# EAGLE design pyboard_arcobaleno (EAGLE 9.5.1)
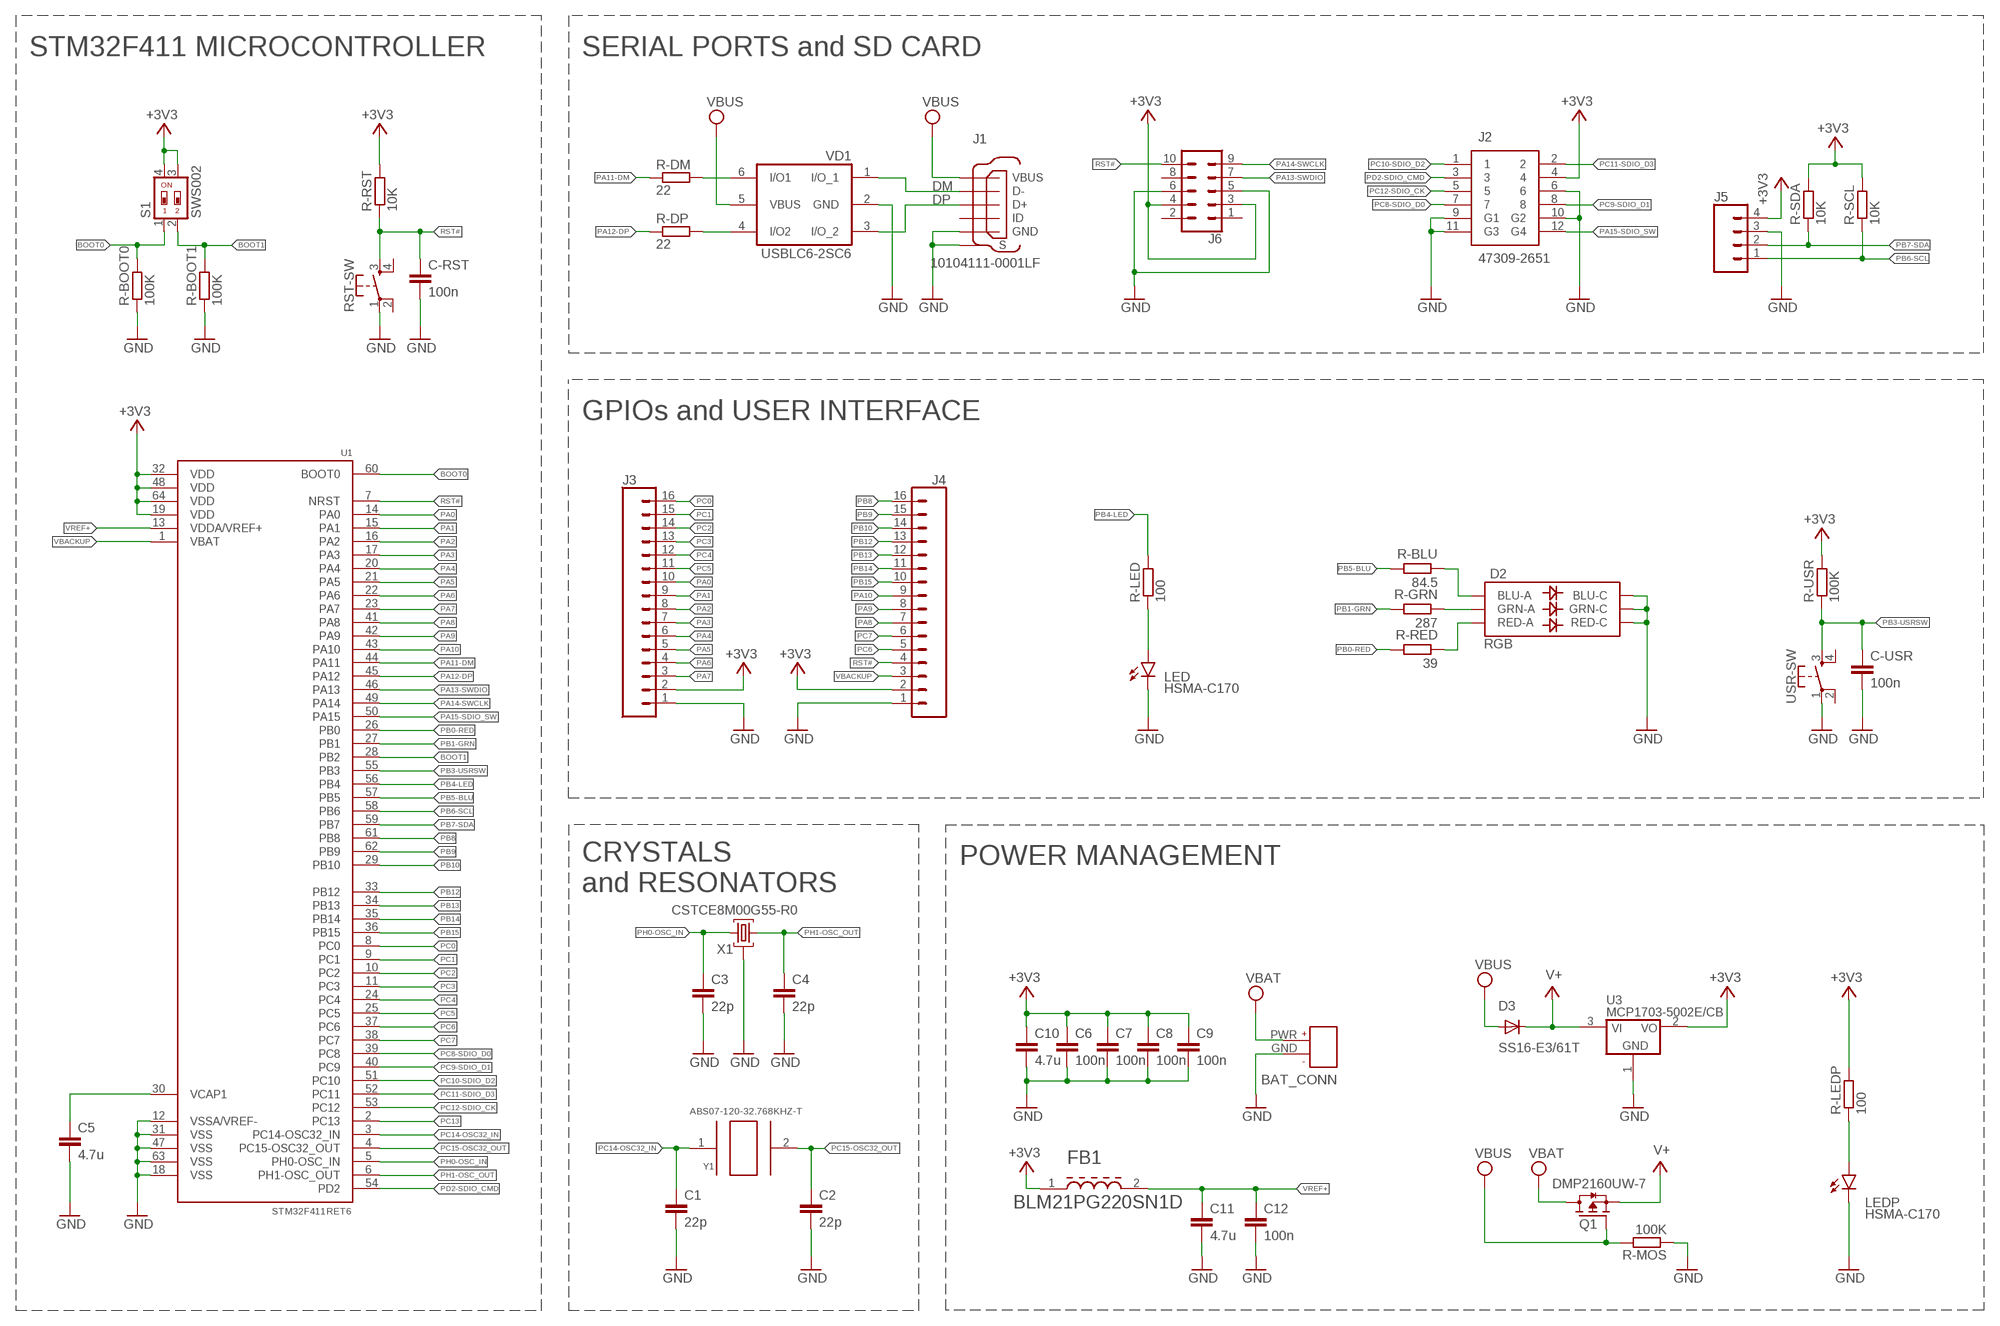
[diagram p0: schematic, sheet 1]

## Parts
BAT_CONN  JST_PH_2PIN  [JST_PH_2PIN]
C1  22p  C-EUC0603  [C0603]
C2  22p  C-EUC0603  [C0603]
C3  22p  C-EUC0603  [C0603]
C4  22p  C-EUC0603  [C0603]
C5  4.7u  C-EUC1608  [C1608]
C6  100n  C-EUC0603  [C0603]
C7  100n  C-EUC0603  [C0603]
C8  100n  C-EUC0603  [C0603]
C9  100n  C-EUC0603  [C0603]
C10  4.7u  C-EUC1608  [C1608]
C11  4.7u  C-EUC1608  [C1608]
C12  100n  C-EUC0603  [C0603]
C-RST  100n  C-EUC0603  [C0603]
C-USR  100n  C-EUC0603  [C0603]
D2  RGB  LED-RGBPLCC-6  [PLCC-6-LED]
D3  SS16-E3/61T  DIODE-DO214AA  [DO214AA]
FB1  MURATA_BLM21PG220SN1DMURATA_BLM21PG220SN1D_0_0  [MURATA_BLM21PG220SN1D_0]
J1  10104111-0001LF  [FRAMATOME_10104111-0001LF]
J2  47309-2651  [47309-2651]
J3  CONN_16  [1X16]
J4  CONN_16  [1X16]
J5  CONN_04  [1X04]
J6  CONN_05X2PTH  [2X5]
LED  HSMA-C170  LEDCHIPLED_0805  [CHIPLED_0805]
LEDP  HSMA-C170  LEDCHIPLED_0805  [CHIPLED_0805]
Q1  DMP2160UW-7  [SOT65P210X110-3N]
R-BLU  84.5  R-EU_R0603  [R0603]
R-BOOT0  100K  R-EU_R0603  [R0603]
R-BOOT1  100K  R-EU_R0603  [R0603]
R-DM  22  R-EU_R0603  [R0603]
R-DP  22  R-EU_R0603  [R0603]
R-GRN  287  R-EU_R0603  [R0603]
R-LED  100  R-EU_R0603  [R0603]
R-LEDP  100  R-EU_R0603  [R0603]
R-MOS  100K  R-EU_R0603  [R0603]
R-RED  39  R-EU_R0603  [R0603]
R-RST  10K  R-EU_R0603  [R0603]
R-SCL  10K  R-EU_R0603  [R0603]
R-SDA  10K  R-EU_R0603  [R0603]
R-USR  100K  R-EU_R0603  [R0603]
RST-SW  MOMENTARY-SWITCH-SPST-2-SMD-5.2MM  [TACTILE_SWITCH_SMD_5.2MM]
S1  SWS002  [SMS-002]
U1  STM32F411RET6  [QFP50P1200X1200X160-64N]
U3  MCP1703-5002E/CB  [SOT23A_MICROCHIP_CB]
USR-SW  MOMENTARY-SWITCH-SPST-2-SMD-5.2MM  [TACTILE_SWITCH_SMD_5.2MM]
VD1  USBLC6-2SC6  [SOT-23-6L]
X1  CSTCE8M00G55-R0  [CSTCE8M00G55-R0]
Y1  ABS07-120-32.768KHZ-T  [XTAL_ABS07-120-32.768KHZ-T]

## Nets
+3V3: C6.1 C7.1 C8.1 C9.1 C10.1 FB1.1 J2.4 J3.2 J4.2 J5.4 J6.3 J6.4 R-LEDP.2 R-RST.2 R-SCL.2 R-SDA.2 R-USR.2 S1.3 S1.4 U1.19(VDD) U1.32(VDD) U1.48(VDD) U1.64(VDD) U3.2(VO)
BOOT0: R-BOOT0.2 S1.1 U1.60(BOOT0)
BOOT1: R-BOOT1.2 S1.2 U1.28(PB2)
DM: J1.2(D-) VD1.1(I/O_1)
DP: J1.3(D+) VD1.3(I/O_2)
GND: BAT_CONN.GND C1.2 C2.2 C3.2 C4.2 C5.2 C6.2 C7.2 C8.2 C9.2 C10.2 C11.2 C12.2 C-RST.2 C-USR.2 D2.CB(BLU-C) D2.CG(GRN-C) D2.CR(RED-C) J1.5(GND) J1.6(S) J1.7(S) J1.8(S) J1.9(S) J2.6 J2.9(G1) J2.10(G2) J2.11(G3) J3.1 J4.1 J5.3 J6.5 J6.6 LED.C LEDP.C R-BOOT0.1 R-BOOT1.1 R-MOS.1 RST-SW.1 U1.12(VSSA/VREF-) U1.18(VSS) U1.31(VSS) U1.47(VSS) U1.63(VSS) U3.1(GND) USR-SW.1 VD1.2(GND) X1.2(GND)
N$1: C5.1 U1.30(VCAP1)
N$2: R-DM.2 VD1.6(I/O1)
N$3: R-DP.2 VD1.4(I/O2)
N$4: LED.A R-LED.1
N$5: LEDP.A R-LEDP.1
N$7: D2.AB(BLU-A) R-BLU.1
N$12: D2.AG(GRN-A) R-GRN.1
N$13: D2.AR(RED-A) R-RED.1
PA0: J3.10 U1.14(PA0)
PA1: J3.9 U1.15(PA1)
PA2: J3.8 U1.16(PA2)
PA3: J3.7 U1.17(PA3)
PA4: J3.6 U1.20(PA4)
PA5: J3.5 U1.21(PA5)
PA6: J3.4 U1.22(PA6)
PA7: J3.3 U1.23(PA7)
PA8: J4.7 U1.41(PA8)
PA9: J4.8 U1.42(PA9)
PA10: J4.9 U1.43(PA10)
PA11-DM: R-DM.1 U1.44(PA11)
PA12-DP: R-DP.1 U1.45(PA12)
PA13-SWDIO: J6.7 U1.46(PA13)
PA14-SWCLK: J6.9 U1.49(PA14)
PA15-SDIO_SW: J2.12(G4) U1.50(PA15)
PB0-RED: R-RED.2 U1.26(PB0)
PB1-GRN: R-GRN.2 U1.27(PB1)
PB3-USRSW: C-USR.1 R-USR.1 U1.55(PB3) USR-SW.3
PB4-LED: R-LED.2 U1.56(PB4)
PB5-BLU: R-BLU.2 U1.57(PB5)
PB6-SCL: J5.1 R-SCL.1 U1.58(PB6)
PB7-SDA: J5.2 R-SDA.1 U1.59(PB7)
PB8: J4.16 U1.61(PB8)
PB9: J4.15 U1.62(PB9)
PB10: J4.14 U1.29(PB10)
PB12: J4.13 U1.33(PB12)
PB13: J4.12 U1.34(PB13)
PB14: J4.11 U1.35(PB14)
PB15: J4.10 U1.36(PB15)
PC0: J3.16 U1.8(PC0)
PC1: J3.15 U1.9(PC1)
PC2: J3.14 U1.10(PC2)
PC3: J3.13 U1.11(PC3)
PC4: J3.12 U1.24(PC4)
PC5: J3.11 U1.25(PC5)
PC6: J4.5 U1.37(PC6)
PC7: J4.6 U1.38(PC7)
PC8-SDIO_D0: J2.7 U1.39(PC8)
PC9-SDIO_D1: J2.8 U1.40(PC9)
PC10-SDIO_D2: J2.1 U1.51(PC10)
PC11-SDIO_D3: J2.2 U1.52(PC11)
PC12-SDIO_CK: J2.5 U1.53(PC12)
PC13: U1.2(PC13)
PC14-OSC32_IN: C1.1 U1.3(PC14-OSC32_IN) Y1.1
PC15-OSC32_OUT: C2.1 U1.4(PC15-OSC32_OUT) Y1.2
PD2-SDIO_CMD: J2.3 U1.54(PD2)
PH0-OSC_IN: C3.1 U1.5(PH0-OSC_IN) X1.1(INPUT)
PH1-OSC_OUT: C4.1 U1.6(PH1-OSC_OUT) X1.3(OUTPUT)
RST#: C-RST.1 J4.4 J6.10 R-RST.1 RST-SW.3 U1.7(NRST)
V+: D3.C Q1.2(S) U3.3(VI)
VBACKUP: J4.3 U1.1(VBAT)
VCC: D3.A J1.1(VBUS) Q1.1(G) R-MOS.2 VD1.5(VBUS) ; supply symbol labelled VBUS
VEE: BAT_CONN.PWR Q1.3(D) ; supply symbol labelled VBAT
VREF+: C11.1 C12.1 FB1.2 U1.13(VDDA/VREF+)
Unconnected: J1.4(ID) J6.1 J6.2 J6.8 RST-SW.2 RST-SW.4 USR-SW.2 USR-SW.4

## Notes on the sheet
- STM32F411 MICROCONTROLLER | SERIAL PORTS and SD CARD
- GPIOs and USER INTERFACE
- POWER MANAGEMENT
- CRYSTALS 
  and RESONATORS

## Library data of the parts
BAT_CONN = kanflo:JST_PH_2PIN: JST PH connector, 2 pins PH has 2.0mm spacing. This connector can be used for LiPo batteries Datasheet <http://www.jst-mfg.com/product/pdf/eng/ePH.pdf>
C1-C4 C6-C9 C12 C-RST C-USR = rcl:C-EU: CAPACITOR, European symbol
C5 C10 C11 = rcl:C-EU: CAPACITOR, European symbol; SPICEPREFIX: C
D2 = SparkFun-LED:LED-RGB: LED-RGB 6 pin RGB LED (no common connector) Packages: PLCC-6 LED-TRICOLOR-5050 - No built-in IC SparkFun Products: Digital Sandbox <https://www.sparkfun.com/products/12651> LED- SMD RGB <https://www.sparkfun.com/products/10866>; PROD_ID: DIO-12113
D3 = mod_diode:DIODE-: DIODE
FB1 = Murata - BLM21PG220SN1D:MURATA_BLM21PG220SN1D: MURA-FB-2; CIIVA_IDS: 1206081; COMPONENT_LINK_1_DESCRIPTION: Manufacturer URL; COMPONENT_LINK_1_URL: http://www.murata.com/; COMPONENT_LINK_3_DESCRIPTION: Package Specification; COMPONENT_LINK_3_URL: http://www.murata.com/products/catalog/pdf/c31e.pdf; DATASHEET: http://www.murata.com/products/catalog/pdf/c31e.pdf; DATASHEET_VERSION: 08/2013; DC_RESISTANCE: 0.009 Ohm Max.; FOOTPRINT_VARIANT_NAME_0: MURA-BLM21-B60-CHIP-2_V3; FOOTPRINT_VARIANT_NAME_1: MURA-BLM21-B60-CHIP-2_V2; FOOTPRINT_VARIANT_NAME_2: MURA-BLM21-B60-CHIP-2_V1; IMPEDANCE_AT_100_MHZ: 22 Ohm +/- 25%; IMPORTED: yes; IMPORTED_FROM: vault; IMPORT_TS: 1521862724; MF: Murata; MOUNTING_TECHNOLOGY: Surface Mount; MPN: BLM21PG220SN1D; OPERATING_TEMPERATURE_RANGE: -55 to 125 degC; PACKAGE: BLM21_H1050-2; PACKAGE_DESCRIPTION: 2-Pin Chip, Body 2 x 1.25 mm; PACKING: Tape and Reel; PREFIX: FB; RATED_CURRENT: 6000 mA; RELEASE_DATE: 1390553358; VAULT_GUID: 886A01B0-1CA3-40C6-A7D4-2A188A11D6CD; VAULT_REVISION: 2B2A5F9E-BB5E-4E0D-8D2F-25FF495DA6A1
J1 = micro_usb_10104111-0001LF:10104111-0001LF: Conn USB Type A/B RCP 5 POS 0.65mm Solder RA SMD 5 Terminal 1 Port T/R; AVAILABILITY: Unavailable; DESCRIPTION: Micro Usb, 2.0 Type Ab, Receptacle, Th; MF: Amphenol ICC; MP: 10104111-0001LF; PACKAGE: None; PRICE: None
J2 = microsd_47309-2651:47309-2651: 1 Micro SD Detect switch 2.65mm height Source: Datasheet <http://www.molex.com/webdocs/datasheets/pdf/en-us//0473092651_MEMORY_CARD_SOCKET.pdf>; ALLIED_NUMBER: 70374474; ALLIED_PRICE-STOCK: https://www.alliedelec.com/molex-incorporated-47309-2651/70374474/; DESCRIPTION: 1 Micro SD Detect switch 2.65mm height; HEIGHT: mm; MANUFACTURER_NAME: Molex; MANUFACTURER_PART_NUMBER: 47309-2651; MOUSER_PART_NUMBER: 538-47309-2651; MOUSER_PRICE-STOCK: https://www.mouser.com/Search/Refine.aspx?Keyword=538-47309-2651; RS_PART_NUMBER: 7025485P; RS_PRICE-STOCK: http://uk.rs-online.com/web/p/products/7025485P
J3 J4 = SparkFun-Connectors:CONN_16: Multi connection point. Often used as Generic Header-pin footprint for 0.1 inch spaced/style header connections On any of the 0.1 inch spaced packages, you can populate with these: Break Away Headers - Straight <https://www.sparkfun.com/products/116> (PRT-00116) Break Away Male Headers - Right Angle <https://www.sparkfun.com/products/553> (PRT-00553) Female Headers <https://www.sparkfun.com/products/115> (PRT-00115) Break Away Headers - Machine Pin <https://www.sparkfun.com/products/117> (PRT-00117) Break Away Female Headers - Swiss Machine Pin <https://www.sparkfun.com/products/743> (PRT-00743) For SCREWTERMINALS and SPRING TERMINALS visit here: Screw Terimnals on SparkFun.com <https://www.sparkfun.com/search/results?term=Screw+Terminals> (5mm/3.5mm/2.54mm spacing) This device is also useful as a general connection point to wire up your design to another part of your project. Our various solder wires solder well into these plated through hole pads. Hook-Up Wire - Assortment (Stranded, 22 AWG) <https://www.sparkfun.com/products/11375> (PRT-11375) Hook-Up Wire - Assortment (Solid Core, 22 AWG) <https://www.sparkfun.com/products/11367> (PRT-11367) View the entire wire category on our website here <https://www.sparkfun.com/categories/141> Special notes: Molex polarized connector foot print use with SKU : PRT-08231 with associated crimp pins and housings. 1MM SMD Version SKU: PRT-10208 NOTES ON THE VARIANTS LOCK and LOCK_LONGPADS... This footprint was designed to help hold the alignment of a through-hole component (i.e. 6-pin header) while soldering it into place. You may notice that each hole has been shifted either up or down by 0.005 of an inch from it's more standard position (which is a perfectly straight line). This slight alteration caused the pins (the squares in the middle) to touch the edges of the holes. Because they are alternating, it causes a "brace" to hold the component in place. 0.005 has proven to be the perfect amount of "off-center" position when using our standard breakaway headers. Although looks a little odd when you look at the bare footprint, once you have a header in there, the alteration is very hard to notice. Also,if you push a header all the way into place, it is covered up entirely on the bottom side.
J5 = SparkFun-Connectors:CONN_04: Multi connection point. Often used as Generic Header-pin footprint for 0.1 inch spaced/style header connections On any of the 0.1 inch spaced packages, you can populate with these: Break Away Headers - Straight <https://www.sparkfun.com/products/116> (PRT-00116) Break Away Male Headers - Right Angle <https://www.sparkfun.com/products/553> (PRT-00553) Female Headers <https://www.sparkfun.com/products/115> (PRT-00115) Break Away Headers - Machine Pin <https://www.sparkfun.com/products/117> (PRT-00117) Break Away Female Headers - Swiss Machine Pin <https://www.sparkfun.com/products/743> (PRT-00743) For SCREWTERMINALS and SPRING TERMINALS visit here: Screw Terimnals on SparkFun.com <https://www.sparkfun.com/search/results?term=Screw+Terminals> (5mm/3.5mm/2.54mm spacing) This device is also useful as a general connection point to wire up your design to another part of your project. Our various solder wires solder well into these plated through hole pads. Hook-Up Wire - Assortment (Stranded, 22 AWG) <https://www.sparkfun.com/products/11375> (PRT-11375) Hook-Up Wire - Assortment (Solid Core, 22 AWG) <https://www.sparkfun.com/products/11367> (PRT-11367) View the entire wire category on our website here <https://www.sparkfun.com/categories/141> Special notes: Molex polarized connector foot print use with SKU : PRT-08231 with associated crimp pins and housings. 1MM SMD Version SKU: PRT-10208; PROD_ID: CONN-09696
J6 = SparkFun-Connectors:CONN_05X2: Multi connection point. Often used as Generic Header-pin footprint for 0.1 inch spaced/style header connections For AVR SPI programming port, see special device with nice symbol: "AVR_SPI_PROG_5x2.dev" You can populate with any combo of single row headers, but if you'd like an exact match, check these: 2x5 AVR ICSP Male Header <https://www.sparkfun.com/products/778> (PRT-00778) 2x5 Pin Shrouded Header <https://www.sparkfun.com/products/8506> (PRT-08506) On any of the 0.1 inch spaced packages, you can populate with these: Break Away Headers - Straight <https://www.sparkfun.com/products/116> (PRT-00116) Break Away Male Headers - Right Angle <https://www.sparkfun.com/products/553> (PRT-00553) Female Headers <https://www.sparkfun.com/products/115> (PRT-00115) Break Away Headers - Machine Pin <https://www.sparkfun.com/products/117> (PRT-00117) Break Away Female Headers - Swiss Machine Pin <https://www.sparkfun.com/products/743> (PRT-00743) Special note: the shrouded connector mates well with our 5x2 ribbon cables: 2x5 Pin IDC Ribbon Cable <https://www.sparkfun.com/products/8535> (PRT-08535); PROD_ID: CONN-08499; SF_ID: PRT-0778
LED LEDP = led:LED: LED OSRAM: - CHIPLED LG R971, LG N971, LY N971, LG Q971, LY Q971, LO R971, LY R971 LH N974, LH R974 LS Q976, LO Q976, LY Q976 LO Q996 - Hyper CHIPLED LW Q18S LB Q993, LB Q99A, LB R99A - SideLED LS A670, LO A670, LY A670, LG A670, LP A670 LB A673, LV A673, LT A673, LW A673 LH A674 LY A675 LS A676, LA A676, LO A676, LY A676, LW A676 LS A679, LY A679, LG A679 - Hyper Micro SIDELED® LS Y876, LA Y876, LO Y876, LY Y876 LT Y87S - SmartLED LW L88C, LW L88S LB L89C, LB L89S, LG L890 LS L89K, LO L89K, LY L89K LS L896, LA L896, LO L896, LY L896 - TOPLED LS T670, LO T670, LY T670, LG T670, LP T670 LSG T670, LSP T670, LSY T670, LOP T670, LYG T670 LG T671, LOG T671, LSG T671 LB T673, LV T673, LT T673, LW T673 LH T674 LS T676, LA T676, LO T676, LY T676, LB T676, LH T676, LSB T676, LW T676 LB T67C, LV T67C, LT T67C, LS T67K, LO T67K, LY T67K, LW E67C LS E67B, LA E67B, LO E67B, LY E67B, LB E67C, LV E67C, LT E67C LW T67C LS T679, LY T679, LG T679 LS T770, LO T770, LY T770, LG T770, LP T770 LB T773, LV T773, LT T773, LW T773 LH T774 LS E675, LA E675, LY E675, LS T675 LS T776, LA T776, LO T776, LY T776, LB T776 LHGB T686 LT T68C, LB T68C - Hyper Mini TOPLED® LB M676 - Mini TOPLED Santana® LG M470 LS M47K, LO M47K, LY M47K Source: http://www.osram.convergy.de LUXEON: - LUMILED® LXK2-PW12-R00, LXK2-PW12-S00, LXK2-PW14-U00, LXK2-PW14-V00 LXK2-PM12-R00, LXK2-PM12-S00, LXK2-PM14-U00 LXK2-PE12-Q00, LXK2-PE12-R00, LXK2-PE12-S00, LXK2-PE14-T00, LXK2-PE14-U00 LXK2-PB12-K00, LXK2-PB12-L00, LXK2-PB12-M00, LXK2-PB14-N00, LXK2-PB14-P00, LXK2-PB14-Q00 LXK2-PR12-L00, LXK2-PR12-M00, LXK2-PR14-Q00, LXK2-PR14-R00 LXK2-PD12-Q00, LXK2-PD12-R00, LXK2-PD12-S00 LXK2-PH12-R00, LXK2-PH12-S00 LXK2-PL12-P00, LXK2-PL12-Q00, LXK2-PL12-R00 Source: www.luxeon.com KINGBRIGHT: KA-3528ASYC Source: www.kingbright.com
Q1 = DMP2160UW-7:DMP2160UW-7: DMP2160UW Series 20 V 100 mOhm P-Channel Enhancement Mode Mosfet - SOT-323; DESCRIPTION: DMP2160UW Series 20 V 100 mOhm P-Channel Enhancement Mode Mosfet - SOT-323; DIGI-KEY_PART_NUMBER: DMP2160UWDICT-ND; DIGI-KEY_PURCHASE_URL: https://www.digikey.com/product-detail/en/diodes-incorporated/DMP2160UW-7/DMP2160UWDICT-ND/2052808?utm_source=snapeda&utm_medium=aggregator&utm_campaign=symbol; MF: Diodes Inc.; MP: DMP2160UW-7; PACKAGE: SOT-323 Diodes Inc.
R-BLU R-BOOT0 R-BOOT1 R-DM R-DP R-GRN R-LED R-LEDP R-MOS R-RED R-RST R-SCL R-SDA R-USR = rcl:R-EU_: RESISTOR, European symbol
RST-SW USR-SW = SparkFun-Switches:MOMENTARY-SWITCH-SPST-2: Momentary Switch (Pushbutton) - SPST - Two Circuits Normally-open (NO) SPST momentary switches (buttons, pushbuttons). Schematic symbol includes two switch circuits. Variants SMD-4.6MMX2.8MM - 4.60mm x 2.80mm Tactile Momentary Button Switch - Used on SparkFun SAMD21 Mini Breakout <https://www.sparkfun.com/products/13664> SMD-5.2MM - Mini Pushbutton Switch - SMD <https://www.sparkfun.com/products/8720> - Used on Arduino Pro Mini <https://www.sparkfun.com/products/11114>; PROD_ID: SWCH-08247; SF_SKU: COM-08720
S1 = smd-special:SWS002: SMD Dip Switch 2 pol.
U1 = STM32F411RET6:STM32F411RET6: High-performance access line, ARM Cortex-M4 core with DSP and FPU, 512 Kbytes Flash, 100 MHz CPU, ART Accelerator; AVAILABILITY: Unavailable; DESCRIPTION: High-performance access line, ARM Cortex-M4 core with DSP and FPU, 512 Kbytes Flash, 100 MHz CPU, ART Accelerator; MF: STMicroelectronics; MP: STM32F411RET6; PACKAGE: LQFP-64 STMicroelectronics; PRICE: None
U3 = MCP1703:MCP1703*02E/CB: MCP1703[A] Series of Voltage Regulators – SOT23A (Microchip CB) (1.2 … 5.0)V, LDO, 16 V Input, 100/150/200/250 mA, Low Quiescent Current Source: http://ww1.microchip.com/downloads/en/DeviceDoc/22049f.pdf http://ww1.microchip.com/downloads/en/DeviceDoc/25122A.pdf Packages: SOT23, Microchip package identifier "CB" (dimensions and recommended land patterns acc. to Microchip) Technologies: MCP1703[A]T-xx02E/CB T : Tape and Reel xx: Output Voltage * 1000 mV; 12|15|18|25|28|30|33|40|50 0 : Extra Feature Code (fixed) 2 : Output volt. Tol.: ±2% (standard) E : Temperature range (−40…+125)°C CB: Package: SOT23A Author: Dipl.-Ing. FH Rainer Bayer HHN Hochschule Heilbronn, rainer.bayer@hs-heilbronn.de Ingenieurbüro ing-rb, mail@ing-rb.de
VD1 = usblc6:USBLC6-2: VERY LOW CAPACITANCE ESD PROTECTION 2 line Datasheet link <http://www.st.com/web/catalog/sense_power/FM114/CL1137/SC1489/PF93353>
X1 = Crystals:CSTCE8M00G55-R0: CER RES 8.0000MHZ 33PF SMD Manufacturer's datasheet <https://www.murata.com/~/media/webrenewal/support/library/catalog/products/timingdevice/ceralock/p16e.ashx>; CREATED_BY: PCBLayout.com; DIGIKEY_PART_NUMBER: 490-1195-2-ND; MANUFACTURER: Murata Electronics North America; MPN: CSTCE8M00G55-R0; PACKAGE: SMD-3
Y1 = ABS07-120-32.768KHZ-T:ABS07-120-32.768KHZ-T: 3.2 x 1.5mm, 32.768KHZ Xtal 6pf, 20ppm, -40+85C, ESR 60kOhm, ST Micro Ref Design Crystal for STM32L; DESCRIPTION: 3.2 x 1.5mm, 32.768KHZ Xtal 6pf, 20ppm, -40+85C, ESR 60kOhm, ST Micro Ref Design Crystal for STM32L; DIGI-KEY_PART_NUMBER: 535-11937-1-ND; DIGI-KEY_PURCHASE_URL: https://www.digikey.com/product-detail/en/abracon-llc/ABS07-120-32.768KHZ-T/535-11937-1-ND/3724046?utm_source=snapeda&utm_medium=aggregator&utm_campaign=symbol; MF: Abracon; MP: ABS07-120-32.768KHZ-T; PACKAGE: SMD-2 Abracon LLC

## Board
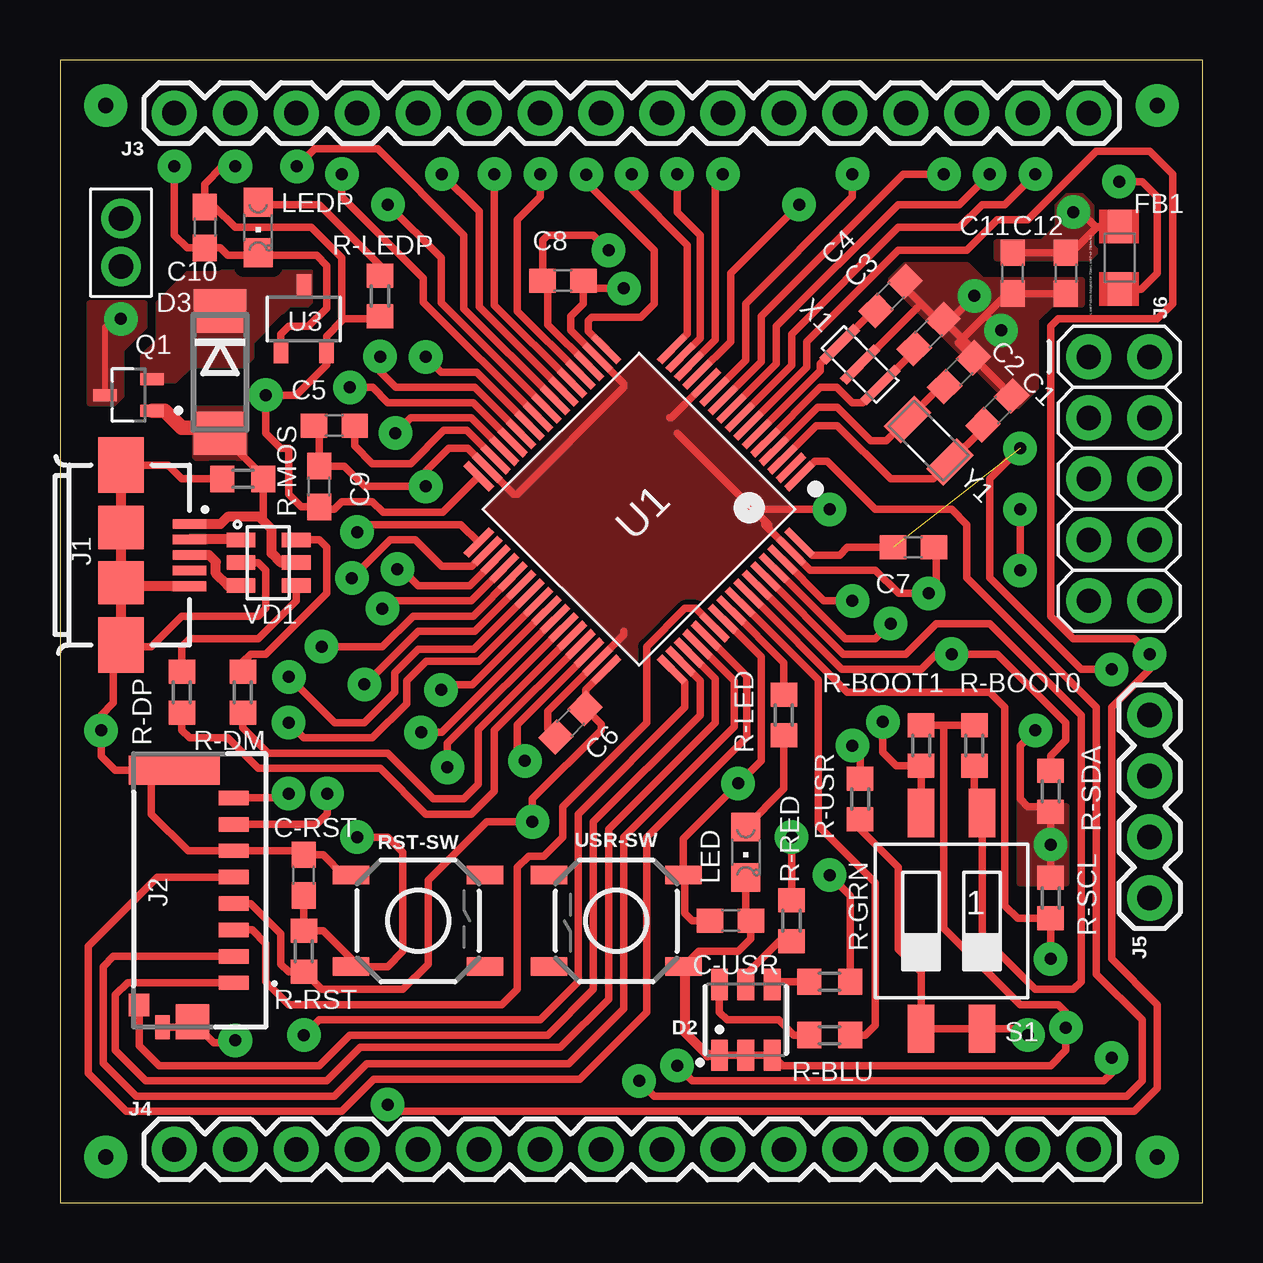
[diagram p1: board, top side]
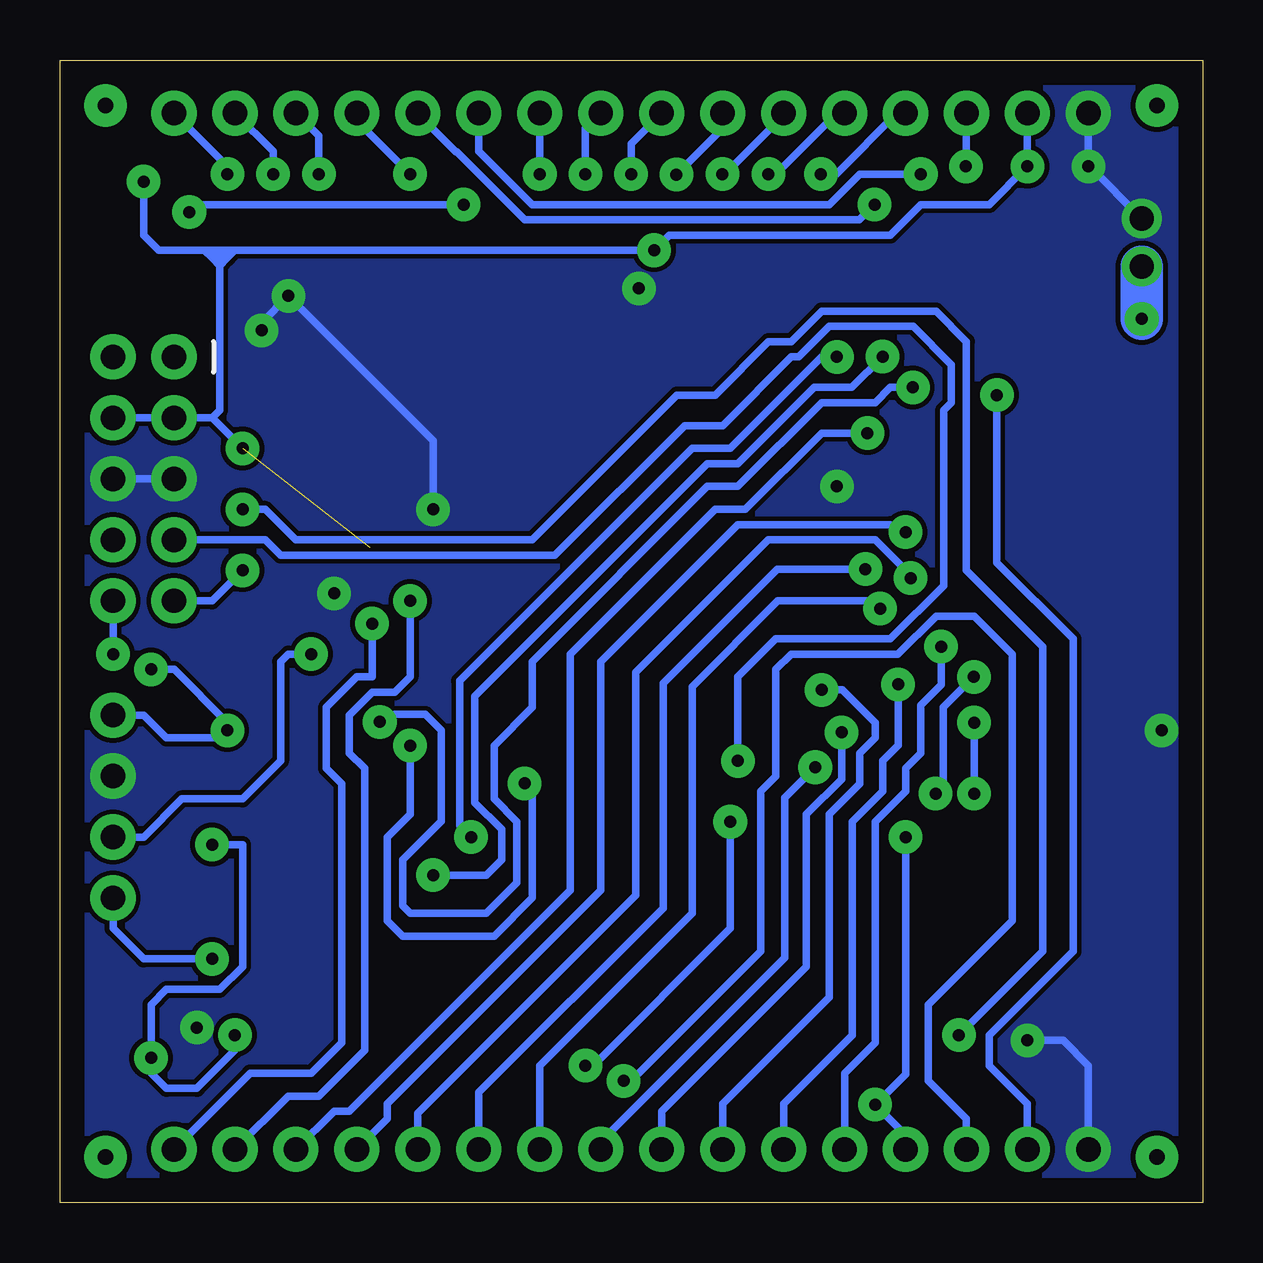
[diagram p2: board, bottom side, seen from below]

Size 47.61 x 47.62 mm. Coordinates in mm from the lower left corner, seen from the top.
Outline: 0,0 47.61,0 47.61,47.62 0,47.62 0,0
Copper layers (1*16): Top 0.035mm / dielectric 1.5mm / Bottom 0.035mm
Design rules "default *": minimum track width 10mil, minimum drill 0.5mm, track to track 8mil, track to pad 8mil, pad to pad 8mil, via to via 8mil, smd to smd 8mil, copper to edge 40mil, drill to drill 8mil, minimum pad ring 10mil, minimum via ring 8mil, stop-mask expansion 4mil, vias tented up to drill 0mil, thermal gap 10mil

### Footprints (pad centres in the part's own frame; a part is rotated, then mirrored left to right if it is on the bottom)
JST_PH_2PIN = drill 1.016 pad 1.651: GND -1,0; PWR 1,0
C0603 = smd 1.1 x 1: 1 -0.85,0; 2 0.85,0
C1608 = smd 1.1 x 1: 1 -0.85,0; 2 0.85,0
PLCC-6-LED = smd 1.3 x 0.7: AB 1.475,1.1; AG 1.475,-1.1; AR 1.475,0; CB -1.475,1.1; CG -1.475,-1.1; CR -1.475,0
DO214AA = smd 1.8 x 2.2: A 2.55,0; C -2.55,0
MURATA_BLM21PG220SN1D_0 = smd 1.4 x 1: 1 -1.3,-0.025; 2 1.3,-0.025
FRAMATOME_10104111-0001LF = smd 0.4 x 1.4: 1 -1.3,2.85; 2 -0.65,2.85; 3 0,2.85; 4 0.65,2.85; 5 1.3,2.85 | smd 2.3 x 1.9: 6 -3.75,0; 9 3.75,0 | smd 1.8 x 1.9: 7 -1.15,0; 8 1.15,0
47309-2651 = smd 0.6 x 1.25: 1 3.85,-1.325; 2 2.75,-1.325; 3 1.65,-1.325; 4 0.55,-1.325; 5 -0.55,-1.325; 6 -1.65,-1.325; 7 -2.75,-1.325; 8 -3.85,-1.325 | smd 1.2 x 3.79: 9 -5,-3.805 | smd 1.45 x 1.4: 10 5.475,-3.05 | smd 1 x 0.6: 11 5.7,-4.3 | smd 0.95 x 0.85: 12 4.775,-5.275
1X16 = drill 1.016 pad 1.88: 1 0,0; 2 2.54,0; 3 5.08,0; 4 7.62,0; 5 10.16,0; 6 12.7,0; 7 15.24,0; 8 17.78,0; 9 20.32,0; 10 22.86,0; 11 25.4,0; 12 27.94,0; 13 30.48,0; 14 33.02,0; 15 35.56,0; 16 38.1,0
1X04 = drill 1.016 pad 1.88: 1 0,0; 2 2.54,0; 3 5.08,0; 4 7.62,0
2X5 = drill 1.016 pad 1.88: 1 0,0; 2 0,2.54; 3 2.54,0; 4 2.54,2.54; 5 5.08,0; 6 5.08,2.54; 7 7.62,0; 8 7.62,2.54; 9 10.16,0; 10 10.16,2.54
CHIPLED_0805 = smd 1.2 x 1.2: A 0,-1.05; C 0,1.05
SOT65P210X110-3N = smd 0.97 x 0.5: 1 -0.98,0.65; 2 -0.98,-0.65; 3 0.98,0
R0603 = smd 1 x 1.1: 1 -0.85,0; 2 0.85,0
TACTILE_SWITCH_SMD_5.2MM = smd 1.524 x 0.762: 1 -2.794,1.905; 2 2.794,1.905; 3 -2.794,-1.905; 4 2.794,-1.905
SMS-002 = smd 1.092 x 2.007: 1 -1.27,-4.496; 2 1.27,-4.496; 3 1.27,4.496; 4 -1.27,4.496
QFP50P1200X1200X160-64N = smd 1.5 x 0.3: 1 -5.7,3.75; 2 -5.7,3.25; 3 -5.7,2.75; 4 -5.7,2.25; 5 -5.7,1.75; 6 -5.7,1.25; 7 -5.7,0.75; 8 -5.7,0.25; 9 -5.7,-0.25; 10 -5.7,-0.75; 11 -5.7,-1.25; 12 -5.7,-1.75; 13 -5.7,-2.25; 14 -5.7,-2.75; 15 -5.7,-3.25; 16 -5.7,-3.75; 33 5.7,-3.75; 34 5.7,-3.25; 35 5.7,-2.75; 36 5.7,-2.25; 37 5.7,-1.75; 38 5.7,-1.25; 39 5.7,-0.75; 40 5.7,-0.25; 41 5.7,0.25; 42 5.7,0.75; 43 5.7,1.25; 44 5.7,1.75; 45 5.7,2.25; 46 5.7,2.75; 47 5.7,3.25; 48 5.7,3.75 | smd 0.3 x 1.5: 17 -3.75,-5.7; 18 -3.25,-5.7; 19 -2.75,-5.7; 20 -2.25,-5.7; 21 -1.75,-5.7; 22 -1.25,-5.7; 23 -0.75,-5.7; 24 -0.25,-5.7; 25 0.25,-5.7; 26 0.75,-5.7; 27 1.25,-5.7; 28 1.75,-5.7; 29 2.25,-5.7; 30 2.75,-5.7; 31 3.25,-5.7; 32 3.75,-5.7; 49 3.75,5.7; 50 3.25,5.7; 51 2.75,5.7; 52 2.25,5.7; 53 1.75,5.7; 54 1.25,5.7; 55 0.75,5.7; 56 0.25,5.7; 57 -0.25,5.7; 58 -0.75,5.7; 59 -1.25,5.7; 60 -1.75,5.7; 61 -2.25,5.7; 62 -2.75,5.7; 63 -3.25,5.7; 64 -3.75,5.7
SOT23A_MICROCHIP_CB = smd 0.6 x 1: 1 -0.95,-1.35; 2 0.95,-1.35; 3 0,1.35
SOT-23-6L = smd 0.6 x 1.2: 1 -0.95,-2.3; 2 0,-2.3; 3 0.95,-2.3; 4 0.95,0; 5 0,0; 6 -0.95,0
CSTCE8M00G55-R0 = smd 0.4 x 2: 1 1.2,0; 2 0,0; 3 -1.2,0
XTAL_ABS07-120-32.768KHZ-T = smd 1 x 1.8: 1 -1.25,0; 2 1.25,0

### Placement (x,y rotation side)
BAT_CONN  2.54,40.01 270 top
C1  39.05,33.02 45 top
C2  37.47,34.61 45 top
C3  36.2,36.2 45 top
C4  34.61,37.78 45 top
C5  11.43,32.38 180 top
C6  21.27,20 225 top
C7  35.56,27.3 0 top
C8  20.95,38.42 0 top
C9  10.79,29.84 90 top
C10  6.03,40.64 270 top
C11  39.69,38.73 270 top
C12  41.91,38.73 270 top
C-RST  10.16,13.65 90 top
C-USR  27.94,11.75 0 top
D2  28.57,7.62 90 top
D3  6.67,34.61 270 top
FB1  44.13,39.37 90 top
J1  2.54,26.99 270 top
J2  8.57,13.02 270 top
J3  4.76,45.4 0 top
J4  4.76,2.22 0 top
J5  45.4,12.7 90 top
J6  42.86,35.24 270 top
LED  28.57,14.61 180 top
LEDP  8.26,40.64 180 top
Q1  2.86,33.66 180 top
R-BLU  32.07,6.99 0 top
R-BOOT0  38.1,19.05 270 top
R-BOOT1  35.88,19.05 270 top
R-DM  7.62,21.27 90 top
R-DP  5.08,21.27 90 top
R-GRN  32.07,9.21 0 top
R-LED  30.16,20.32 90 top
R-LEDP  13.34,37.78 270 top
R-MOS  7.62,30.16 0 top
R-RED  30.48,11.75 90 top
R-RST  10.16,10.48 270 top
R-SCL  41.27,12.7 90 top
R-SDA  41.27,17.14 270 top
R-USR  33.34,16.83 270 top
RST-SW  14.92,11.75 0 top
S1  37.15,11.75 180 top
U1  24.13,28.89 225 top
U3  10.16,36.83 0 top
USR-SW  23.18,11.75 180 top
VD1  9.84,26.67 270 top
X1  33.34,34.92 315 top
Y1  36.2,31.75 135 top

### Tracks (layer width: path | path; a pad name or v marks a point on that pad's centre or on a via)
+3V3  (via drill 0.5 pad 1.4)  (1 unrouted)
  Top 0.305: J2.4 7.96,12.47 9.21,11.21 9.21,9.95 9.53,9.63 R-RST.2 10.9,8.89 14.29,8.89 15.34,9.94 15.34,13.44 17.78,15.88 v19.68,15.88 19.68,16.83 22.54,19.68 22.54,19.93 C6.1 21.91,20.64 21.91,21.37 U1.48 | U1.19 20.32,36.59 20.32,38.2 C8.1 20.11,40.11 20.32,40.32 22.23,40.32 v22.86,39.69 | 17.24,30.48 U1.32 15.94,28.77 13.46,28.77 13.02,29.21 11.75,29.21 11.43,28.89 10.9,28.89 C9.1 10.06,29 9.53,29.53 9.53,31.43 9.21,31.43 8.57,32.07 v8.57,33.66 9.84,33.66 11.11,34.92 U3.2 11.11,36.12 11.75,36.75 11.75,36.83 | U1.64 31.34,26.99 32.49,26.99 32.8,27.3 C7.1 | 11.75,36.83 11.75,39.37 10.48,40.64 7.3,40.64 6.45,41.49 C10.1 6.03,42.44 6.77,43.18 v7.3,43.18 | v40.01,31.43 38.73,30.16 38.73,26.04 42.55,22.23 v43.81,22.23 | R-USR.2 33.34,15.56 34.92,13.97 34.92,10.56 35.88,9.61 S1.3 S1.4 40.06,7.25 v40.32,6.99 | R-SCL.2 v41.27,14.92 R-SDA.2 41.06,16.51 40.32,16.51 40.01,16.83 40.01,19.05 v40.64,19.68 | v25.72,5.71 26.35,5.08 43.5,5.08 43.81,5.4 v43.81,6.03 | FB1.1 45.05,38.07 45.72,38.73 45.72,41.91 45.09,42.55 v44.13,42.55 | R-LEDP.2 13.23,36.83 11.75,36.83
  Bottom 0.305: J3.2 v7.3,43.18 8.89,41.59 11.75,41.59 13.02,40.32 22.23,40.32 v22.86,39.69 40.32,39.69 | 41.27,32.7 40.96,33.02 40.96,39.05 | 41.27,32.7 J6.3 J6.4 | J5.4 44.13,20.32 43.18,19.37 40.96,19.37 v40.64,19.68 40.64,20 42.86,22.23 v43.81,22.23 | 41.27,32.7 v40.01,31.43 | v40.32,6.99 40.32,6.35 41.91,4.76 43.18,4.76 43.81,5.4 v43.81,6.03 43.81,8.26 43.18,8.89 40.96,8.89 40.01,9.84 40.01,14.92 v41.27,14.92 | J4.2 7.3,4.13 8.89,5.71 8.89,6.99 5.4,10.48 5.4,23.5 8.57,26.67 v8.57,33.66 | v19.68,15.88 19.68,11.43 25.4,5.71 v25.72,5.71 | v44.13,42.55 44.13,40.32 43.5,39.69 41.59,39.69 | 40.32,39.69 40.64,39.37 | 40.64,39.37 40.96,39.05 | 40.32,39.69 40.96,39.69 | 40.96,39.69 41.59,39.69 | 40.96,39.05 41.27,39.37 | 41.27,39.37 41.59,39.69 | 40.96,39.05 40.96,39.69 | 40.64,39.37 41.27,39.37
  pour Top (no thermals): 41.91,13.34 41.91,16.51 40.32,16.51 40.01,16.83 40.01,13.34
BOOT0
  Top 0.305: R-BOOT0.2 38.1,17.2 38.42,16.88 S1.1 38.42,11.11 40.64,8.89 42.23,8.89 42.55,9.21 42.55,20.32 38.73,24.13 36.51,24.13 35.24,22.86 32.64,22.86 U1.60
BOOT1  (via drill 0.5 pad 1.4)
  Top 0.305: v34.29,20.03 34.29,18.76 34.85,18.2 R-BOOT1.2 S1.2 | U1.28 17.21,33.34 13.66,33.34 13.03,33.97 v12.08,33.97
  Bottom 0.305: v34.29,20.03 33.97,20.03 33.66,20.35 32.38,20.35 31.72,19.68 31.72,15.9 33.34,14.29 33.34,12.38 33.02,12.06 29.84,12.06 28.57,13.34 28.57,15.88 29.53,16.83 29.53,19.05 27.94,20.64 27.94,22.54 20.64,29.84 19.37,29.84 15.88,33.34 13.65,33.34 13.02,33.97 v12.08,33.97
DM
  Top 0.406: J1.2 7.53,27.64 VD1.1
DP
  Top 0.406: J1.3 6.21,26.99 6.5,26.71 6.5,26.21 6.99,25.72 VD1.3
GND  (via drill 0.5 pad 1.4)
  Top 0.305: RST-SW.1 11.81,13.65 10.96,14.5 C-RST.2 9.99,14.67 J2.6 5.33,14.67 3.81,16.19 3.81,18.1 3.89,18.02 J2.9 2.3,18.02 1.71,18.61 v1.71,19.68 1.71,20.32 2.22,20.83 2.22,22.92 J1.9 2.6,23.18 3.81,23.18 5.08,24.45 8.26,24.45 8.57,24.77 8.57,26.35 8.26,26.67 VD1.2 | X1.2 35.88,37.47 | 35.88,37.47 35.21,38.13 C4.2 | C3.2 36.55,36.8 35.88,37.47 | C2.2 38.07,35.53 C3.2 | C1.2 C2.2 | R-BOOT0.1 36.83,19.9 | 36.83,19.9 R-BOOT1.1 | 29.53,28.09 U1.63 31.27,26.35 33.97,26.35 34.94,25.39 v36.2,25.39 36.51,25.7 36.51,27.2 C7.2 | 29.53,28.09 29.53,28.26 29.37,28.42 | 28.89,28.89 29.37,28.42 | D2.CB D2.CR D2.CG 30.11,5.71 41.27,5.71 41.91,6.35 v41.91,7.3 41.91,7.94 41.59,8.26 40.01,8.26 36.83,11.43 36.83,19.9 | J2.11 5.3,7.32 J2.10 6.4,6.67 7.2,6.67 v7.3,6.77 | U3.1 9.21,36.2 9.53,36.51 10.35,36.51 11.11,37.27 11.11,39.05 10.69,39.47 8.26,39.47 | C6.2 20.32,19.75 20.32,20.49 U1.47 23.5,23.66 23.5,23.81 | USR-SW.1 26.35,9.84 | 38.58,36.99 37.43,35.84 C2.2 | 29.53,28.09 29.37,28.25 29.37,28.42 | J1.6 4.5,30.74 5.08,30.16 R-MOS.1 | USR-SW.1 26.04,9.78 | 38.58,36.99 v39.21,36.35 | v38.1,37.78 37.11,36.8 C3.2 | 25.72,32.07 28.89,28.89 | 28.89,28.89 v32.07,28.89 | 8.26,39.47 6.99,39.47 6.67,39.79 C10.2 5.29,39.79 4.76,40.32 v4.76,43.18 | v23.5,38.1 22.12,38.1 C8.2 21.8,37.47 21.27,36.93 21.27,36.35 U1.18 23.5,34.12 23.5,33.97 19.05,29.53 18.9,29.53 U1.31 16.99,31.43 16.19,31.43 15.24,30.48 v15.24,29.84 12.7,29.84 11.85,30.7 C9.2 10.79,32.07 10.64,32.23 10.64,32.33 C5.2 | C12.2 C11.2 39.47,37.88 38.58,36.99 | LEDP.C 8.26,39.47 | U1.12 25.46,32.7 25.4,32.7 | USR-SW.1 26.61,10.48 28.26,10.48 28.79,11.01 C-USR.2 28.57,11.96 LED.C
  Top 0.406: J1.5 2.69,25.69 J1.8 | J1.6 J1.7 J1.8 | J1.8 J1.9 | D2.CB 26.99,6.14 26.04,7.1 26.04,9.78
  Bottom 0.305: J3.1 v4.76,43.18 4.71,43.18 BAT_CONN.GND | J4.1 4.76,5.71 5.82,6.77 v7.3,6.77 | v39.21,36.35 39.21,36.67 v38.1,37.78 32.07,31.75 v32.07,28.89 | J6.6 J6.5
  pour Top (no thermals): 17.78,28.89 24.13,22.54 30.48,28.89 24.13,35.24
  pour Top (no thermals): 34.61,38.42 35.24,39.05 37.78,39.05 40.64,36.2 40.64,33.97 39.85,33.18
  pour Bottom (no thermals): 0.32,47.31 47.31,47.31 47.31,0.32 0.32,0.32
  pour Top (no thermals): 40.64,36.2 40.64,36.83 41.27,37.47 42.55,37.47 42.55,38.42 38.42,38.42 38.42,37.15 39.37,37.15 40.32,36.2
N$1
  Top 0.305: U1.30 16.95,32.19 15.99,32.19 14.61,30.8 13.02,30.8 12.28,31.54 C5.1
N$2
  Top 0.305: R-DM.2 7.62,22.54 7.94,22.86 8.57,22.86 11.11,25.4 11.11,27.3 10.8,27.62 VD1.6
N$3
  Top 0.305: R-DP.2 5.08,23.18 5.4,23.5 8.26,23.5 9.84,25.08 VD1.4
N$4
  Top 0.305: LED.A 30.16,17.24 R-LED.1
N$5
  Top 0.305: LEDP.A 8.35,41.59 10.79,41.59 13.34,39.05 R-LEDP.1
N$6  (via drill 0.64 pad 1.78)
  other vias: 1.91,45.72
N$7
  Top 0.305: D2.AB 27.48,7.94 27.79,7.62 29.95,7.62 30.58,6.99 R-BLU.1
N$8  (via drill 0.64 pad 1.78)
  other vias: 1.91,1.91
N$9  (via drill 0.64 pad 1.78)
  other vias: 45.72,1.91
N$10  (via drill 0.64 pad 1.78)
  other vias: 45.72,45.72
N$12
  Top 0.305: R-GRN.1 29.79,9.21 D2.AG
N$13
  Top 0.305: D2.AR 28.57,9.5 29.98,10.9 R-RED.1
PA0  (via drill 0.5 pad 1.4)
  Top 0.305: U1.14 27.3,35.96 27.3,42.55 v27.62,42.86
  Bottom 0.305: v27.62,42.86 J3.10
PA1  (via drill 0.5 pad 1.4)
  Top 0.305: U1.15 26.67,36.03 26.67,40.32 25.72,41.27 v25.72,42.86
  Bottom 0.305: J3.9 25.72,44.77 v25.72,42.86
PA2  (via drill 0.5 pad 1.4)
  Top 0.305: U1.16 26.14,36.21 26.14,39.9 23.81,42.23 v23.81,42.86
  Bottom 0.305: J3.8 23.81,44.13 v23.81,42.86
PA3  (via drill 0.5 pad 1.4)
  Top 0.305: U1.17 22.02,36.31 22.02,36.75 22.16,36.89 24.19,36.89 24.77,37.47 24.77,39.69 21.93,42.52 v21.93,42.84
  Bottom 0.305: J3.7 20,44.77 v21.93,42.84
PA4  (via drill 0.5 pad 1.4)
  Top 0.305: U1.20 19.05,37.15 19.05,40.96 20.02,41.92 v20.02,42.86
  Bottom 0.305: v20.02,42.86 19.91,42.86 17.46,45.31 J3.6
PA5  (via drill 0.5 pad 1.4)
  Top 0.305: U1.21 18.1,37.4 v18.1,42.86
  Bottom 0.305: v18.1,42.86 17.78,42.86 15.24,45.4 J3.5
PA6  (via drill 0.5 pad 1.4)
  Top 0.305: U1.22 17.46,37.33 17.46,41.31 v15.91,42.86
  Bottom 0.305: v15.91,42.86 15.28,42.86 12.74,45.4 J3.4
PA7  (via drill 0.5 pad 1.4)
  Top 0.305: v9.87,43.18 10.6,43.92 13.23,43.92 16.83,40.32 16.83,37.26 U1.23
  Bottom 0.305: v9.87,43.18 9.84,43.18 J3.3
PA8  (via drill 0.5 pad 1.4)
  Top 0.305: U1.41 17.18,21.59 16.09,21.59 v15.88,21.37
  Bottom 0.305: v15.88,21.37 15.02,21.37 13.65,20 13.65,19.37 14.29,18.73 14.29,17.46 15.56,16.19 15.56,8.57 20,4.13 J4.7
PA9  (via drill 0.5 pad 1.4)
  Top 0.305: v15.05,19.6 15.9,19.6 U1.42
  Bottom 0.305: v15.05,19.6 15.05,17.66 16.51,16.19 16.51,9.84 22.54,3.81 J4.8
PA10  (via drill 0.5 pad 1.4)
  Top 0.305: U1.43 16.14,19.14 v16.14,18.15
  Bottom 0.305: v16.14,18.15 17.41,16.88 17.41,10.21 25.08,2.54 J4.9
PA11-DM
  Top 0.305: R-DM.1 7.62,19.79 8.68,18.73 13.65,18.73 15.56,16.83 16.83,16.83 17.43,17.43 17.43,19.72 U1.44
PA12-DP
  Top 0.305: R-DP.1 5.08,19.68 5.4,19.37 6.99,19.37 8.26,18.1 13.34,18.1 15.24,16.19 17.14,16.19 18.1,17.15 18.1,19.68 U1.45
PA13-SWDIO  (via drill 0.5 pad 1.4)
  Top 0.305: U1.46 19.05,19.92 19.05,18.73 v19.37,18.41
  Bottom 0.305: v19.37,18.41 19.37,21.91 17.78,23.5 13.02,23.5 10.79,25.72 10.79,33.02 10.48,33.34 10.48,34.92 12.06,36.51 15.56,36.51 16.83,35.24 17.14,35.24 20,32.38 21.59,32.38 26.99,26.99 38.42,26.99 39.05,27.62 J6.7
PA14-SWCLK  (via drill 0.5 pad 1.4)
  Top 0.305: U1.49 26.04,21.68 26.04,20.64 21.59,16.19 21.59,9.21 20,7.62 10.79,7.62 v10.16,6.99 | v40.01,28.89 v40.01,26.35
  Bottom 0.305: v10.16,6.99 6.67,10.48 6.67,23.18 9.84,26.35 9.84,35.88 11.11,37.15 15.88,37.15 17.14,35.88 18.1,35.88 20.32,33.66 21.91,33.66 27.94,27.62 37.78,27.62 39.05,28.89 v40.01,28.89 | v40.01,26.35 41.27,25.08 J6.9
PA15-SDIO_SW
  Top 0.305: J2.12 3.3,6.54 4.13,5.71 10.79,5.71 12.06,6.99 20.32,6.99 22.23,8.89 22.23,15.88 26.67,20.32 26.67,21.76 U1.50
PB0-RED  (via drill 0.5 pad 1.4)
  Top 0.305: R-RED.2 v30.48,15.24 | v15.24,35.24 15.88,34.61 17.35,34.61 U1.26
  Bottom 0.305: v30.48,15.24 30.96,15.72 30.96,21.75 21.27,31.43 19.68,31.43 15.88,35.24 v15.24,35.24
PB1-GRN  (via drill 0.5 pad 1.4)
  Top 0.305: v32.07,13.65 32.92,12.8 R-GRN.2 | U1.27 17.28,33.97 13.98,33.97 13.34,34.62 v13.34,35.26
  Bottom 0.305: v13.34,35.26 14.62,33.97 16.19,33.97 19.37,30.8 20.64,30.8 30.32,21.11 30.32,16.67 29.21,15.56 29.21,14.29 29.84,13.65 v32.07,13.65
PB3-USRSW  (via drill 0.5 pad 1.4)
  Top 0.305: U1.55 29.21,22.75 29.21,18.43 v28.26,17.47 v28.26,17.46 25.97,15.18 USR-SW.3 26.04,13.59 26.04,12.06 26.35,11.75 C-USR.1 | v33.02,19.05 33.34,18.73 R-USR.1
  Bottom 0.305: v28.26,17.47 27.94,17.16 27.94,12.7 29.53,11.11 33.34,11.11 33.97,11.75 33.97,15.24 33.02,16.19 v33.02,19.05
PB4-LED
  Top 0.305: R-LED.2 30.16,22.51 U1.56
PB5-BLU
  Top 0.305: R-BLU.2 33.55,6.99 33.97,7.41 33.97,13.34 31.59,15.72 31.59,21.79 U1.57
PB6-SCL  (via drill 0.5 pad 1.4)
  Top 0.305: U1.58 32.81,21.27 38.73,21.27 39.37,20.64 39.37,12.38 39.9,11.85 R-SCL.1 v41.27,10.16
  Bottom 0.305: v41.27,10.16 44.13,10.16 45.4,11.43 J5.1
PB7-SDA  (via drill 0.5 pad 1.4)
  Top 0.305: U1.59 32.56,22.23 35.88,22.23 36.51,22.86 v37.15,22.86 39.05,22.86 41.91,20 41.91,19.27 41.27,18.63 R-SDA.1
  Bottom 0.305: v37.15,22.86 38.1,22.86 38.42,22.54 38.42,18.41 40.01,16.83 42.55,16.83 44.13,15.24 J5.2
PB8  (via drill 0.5 pad 1.4)
  Top 0.305: U1.61 32.71,23.5 33.97,23.5 v34.61,24.13
  Bottom 0.305: J4.16 39.69,5.4 37.15,5.4 35.88,6.67 35.88,17.46 36.51,18.1 36.51,20.64 35.24,21.91 34.61,21.91 v34.61,24.13
PB9  (via drill 0.5 pad 1.4)
  Top 0.305: U1.62 31.83,25.08 v33.02,25.08
  Bottom 0.305: v33.02,25.08 33.02,21.91 33.66,21.27 34.61,21.27 35.56,20.32 35.56,18.73 34.92,18.1 34.92,6.35 36.83,4.45 38.1,4.45 J4.15
PB10  (via drill 0.5 pad 1.4)
  Top 0.305: U1.29 17.14,32.7 14.61,32.7 v13.97,32.07
  Bottom 0.305: v13.97,32.07 15.88,32.07 19.05,28.89 20.32,28.89 26.35,22.86 26.35,13.02 35.56,3.81 36.2,3.81 J4.14
PB12  (via drill 0.5 pad 1.4)
  Top 0.305: U1.33 16.7,28.26 12.7,28.26 v12.38,27.94
  Bottom 0.305: v12.38,27.94 12.7,27.94 13.02,28.26 19.37,28.26 25.08,22.54 25.08,13.02 33.97,4.13 33.97,3.49 J4.13
PB13  (via drill 0.5 pad 1.4)
  Top 0.305: U1.34 17.17,26.52 15.9,26.52 14.8,27.62 13.77,27.62 v12.17,26.02
  Bottom 0.305: v12.17,26.02 12.17,26.14 13.65,27.62 18.1,27.62 23.62,22.1 23.62,12.81 32.7,3.73 J4.12
PB14  (via drill 0.5 pad 1.4)
  Top 0.305: U1.35 17.07,25.72 14.92,25.72 14.24,26.4 v14.06,26.4
  Bottom 0.305: v14.06,26.4 17.73,26.4 22.48,21.65 22.48,12.28 30.16,4.6 J4.11
PB15  (via drill 0.5 pad 1.4)
  Top 0.305: U1.36 17.14,25.08 13.76,25.08 v13.44,24.76
  Bottom 0.305: v13.44,24.76 13.76,25.08 17.7,25.08 21.27,21.51 21.27,12.06 27.62,5.71 J4.10
PC0  (via drill 0.5 pad 1.4)
  Top 0.305: U1.8 30.48,34.89 30.48,36.2 34.92,40.64 37.47,40.64 38.42,41.59 39.37,41.59 v40.64,42.86
  Bottom 0.305: v40.64,42.86 40.64,43.18 J3.16
PC1  (via drill 0.5 pad 1.4)
  Top 0.305: U1.9 29.84,34.96 29.84,36.51 34.92,41.59 37.47,41.59 v38.73,42.86
  Bottom 0.305: v38.73,42.86 38.73,43.81 J3.15
PC2  (via drill 0.5 pad 1.4)
  Top 0.305: v36.83,42.86 35.13,42.86 29.22,36.95 29.22,35.04 U1.10
  Bottom 0.305: v36.83,42.86 36.83,44.45 J3.14
PC3  (via drill 0.5 pad 1.4)
  Top 0.305: U1.11 28.57,35.1 28.57,37.47 33.02,41.91 v33.02,42.86
  Bottom 0.305: J3.13 35.24,45.09 v33.02,42.86
PC4  (via drill 0.5 pad 1.4)
  Top 0.305: U1.24 15.88,37.5 15.88,39.38 v13.66,41.59
  Bottom 0.305: v13.66,41.59 14.3,40.96 28.26,40.96 31.09,43.79 31.11,43.79 32.7,45.38 J3.12
PC5  (via drill 0.5 pad 1.4)
  Top 0.305: U1.25 15.14,37.53 15.14,38.51 11.75,41.91 v11.75,42.86
  Bottom 0.305: v11.75,42.86 14.29,42.86 15.56,41.59 27.94,41.59 30.16,43.81 J3.11
PC6  (via drill 0.5 pad 1.4)
  Top 0.305: U1.37 17.21,24.45 14.71,24.45 13.44,23.17 v10.9,23.17
  Bottom 0.305: v10.9,23.17 10.9,21.59 11.75,20.73 11.75,18.73 12.38,18.1 12.38,17.14 13.65,15.88 13.65,6.67 14.92,5.4 J4.5
PC7  (via drill 0.5 pad 1.4)
  Top 0.305: U1.38 17.28,23.81 14.92,23.81 12.71,21.6 v12.69,21.6
  Bottom 0.305: v12.69,21.6 12.69,19.06 13.34,18.41 13.34,17.14 14.61,15.88 14.61,6.99 17.46,4.13 J4.6
PC8-SDIO_D0  (via drill 0.5 pad 1.4)
  Top 0.305: J2.7 10.69,15.77 11.12,16.2 v11.12,17.04 | U1.39 17.25,23.07 14.92,23.07 13.94,22.09 13.94,21.27 12.67,20 11.44,20 v9.54,21.91
  Bottom 0.305: v9.54,21.91 10.81,20.64 10.81,17.36 v11.12,17.04
PC9-SDIO_D1  (via drill 0.5 pad 1.4)
  Top 0.305: J2.8 9.25,16.87 9.42,17.04 v9.53,17.04 | v9.53,20 10.16,19.37 13.02,19.37 14.45,20.8 14.45,21.75 15.26,22.56 17.44,22.56 U1.40
  Bottom 0.305: v9.53,17.04 v9.53,20
PC10-SDIO_D2
  Top 0.305: J2.1 2.82,9.17 2.31,8.66 2.31,6.35 3.58,5.08 11.11,5.08 12.51,6.48 20.85,6.48 22.86,8.49 22.86,15.56 27.3,20 27.3,21.83 U1.51
PC11-SDIO_D3
  Top 0.305: J2.2 2.23,10.27 1.8,9.84 1.8,5.82 3.17,4.45 11.43,4.45 12.78,5.79 21.2,5.79 23.5,8.09 23.5,15.24 28.09,19.84 28.09,21.75 U1.52
PC12-SDIO_CK
  Top 0.305: J2.5 4.04,13.57 1.17,10.69 1.17,5.4 2.76,3.81 11.75,3.81 13.08,5.14 21.65,5.14 24.45,7.94 24.45,15.24 28.61,19.4 28.61,21.94 U1.53
PC14-OSC32_IN
  Top 0.305: C1.1 38.45,32.24 Y1.1 36.38,30.16 34.61,30.16 32.38,32.38 31.51,32.38 U1.3
PC15-OSC32_OUT
  Top 0.305: C2.1 36.68,34.01 Y1.2 34.43,31.75 33.78,31.75 32.38,33.15 31.57,33.15 U1.4
PD2-SDIO_CMD
  Top 0.305: J2.3 8,11.37 8.57,10.79 8.57,9.21 9.53,8.26 18.41,8.26 19.05,8.89 19.05,13.97 19.53,14.45 20.16,14.45 20.95,15.24 20.95,16.51 24.45,20 24.45,23.18 26.04,24.77 26.49,24.77 U1.54
PH0-OSC_IN
  Top 0.305: C3.1 35.59,35.48 X1.1 33.45,33.34 33.01,33.34 32.37,33.97 31.68,33.97 U1.5
PH1-OSC_OUT
  Top 0.305: U1.6 31.68,34.68 31.68,34.97 X1.3 33.9,37.18 C4.1
RST#  (via drill 0.5 pad 1.4)
  Top 0.305: U1.7 31.11,34.82 31.11,35.88 34.92,39.69 37.78,39.69 39.05,40.96 40.32,40.96 43.18,43.81 45.4,43.81 46.35,42.86 46.35,37.47 45.72,36.83 41.59,36.83 41.27,36.51 41.27,24.45 42.23,23.5 44.77,23.5 v45.4,22.86 45.4,22.23 43.81,20.64 43.81,10.16 45.72,8.26 45.72,4.76 44.77,3.81 13.93,3.81 v13.65,4.09 | C-RST.1 R-RST.1 10.96,11.33 12.13,10.16 RST-SW.3 13.65,9.84 14.29,10.48 14.29,14.61 13.65,15.24 v12.38,15.24
  Bottom 0.305: v12.38,15.24 12.38,5.36 v13.65,4.09 12.38,2.82 J4.4 | v45.4,22.86 J6.10
V+
  Top 0.305: Q1.2 3.85,34.29
  pour Top (isolate 0.406, no thermals): 3.49,34.29 4.76,34.29 5.4,34.92 7.62,34.92 7.94,35.24 7.94,35.88 9.53,37.47 10.48,37.47 10.48,38.73 5.4,38.73 4.13,37.47 4.13,35.88 3.49,35.24
VBACKUP  (via drill 0.5 pad 1.4)
  Top 0.305: U1.1 31.45,30.91 31.96,30.91 33.97,28.89 37.15,28.89 37.78,28.26 37.78,26.04 43.18,20.64 43.18,9.53 45.09,7.62 45.09,5.08 44.45,4.45 24.77,4.45 v24.13,5.08
  Bottom 0.305: J4.3 9.84,3.49 11.43,5.08 11.43,8.26 7.94,11.75 7.94,22.86 9.53,24.45 11.11,24.45 12.7,22.86 17.14,22.86 17.78,22.23 17.78,17.78 18.41,17.14 18.41,10.48 23.81,5.08 v24.13,5.08
VCC
  Top 0.305: 8.82,28.07 8.47,28.41 R-MOS.2 8.47,30.27 6.35,32.38
  Top 0.406: J1.1 6.7,28.29 6.99,28.57 8.31,28.57 8.82,28.07 8.82,27.06 9.21,26.67 VD1.5
  Top 0.61: Q1.1 4.37,33.01 5.08,32.29 5.94,32.29 6.03,32.38 6.35,32.38
  pour Top (no thermals): 7.62,31.11 5.71,31.11 5.71,33.02 7.62,33.02
VEE  (via drill 0.5 pad 1.4)
  Top 0.254: Q1.3 1.88,36.48 2.22,36.83 v2.54,36.83
  Bottom 1.778: v2.54,36.83 BAT_CONN.PWR
  pour Top (isolate 0.406, no thermals): 1.27,33.34 2.22,33.34 2.54,33.66 2.54,35.56 3.49,36.51 3.49,37.47 1.27,37.47
VREF+  (via drill 0.5 pad 1.4)
  Top 0.305: C11.1 C12.1 42.12,39.59 43.21,40.67 FB1.2 44.16,40.64 43.18,40.64 42.55,41.27 v42.23,41.27 | U1.13 27.94,35.88 27.94,38.73 v30.8,41.59
  Bottom 0.305: v30.8,41.59 41.91,41.59 v42.23,41.27
  pour Top (no thermals): 39.05,40.01 40.96,40.01 41.59,40.64 41.59,41.59 41.91,41.91 42.55,41.91 43.18,41.27 44.77,41.27 44.77,40.01 43.5,40.01 42.86,39.37 39.05,39.37

### Text on the board
bDocu: GND | +3V3 | PA7 | PA6 | PA5 | PA4 | PA3 | PA2 | PA1 | PA0 | PC5 | PC4 | PC3 | PC2 | PC1 | PC0 | +3V3 | GND | VBACKUP | PB7-SDA | PB6-SCL | GND | +3V3 | /RTS | PA10 | PB15 | PB14 | PB13 | PB12 | PB10 | PC6 | PC7 | PA8 | PA9 | PB9 | PB8